# Altium schematic sheet motor_main.SchDoc
size A
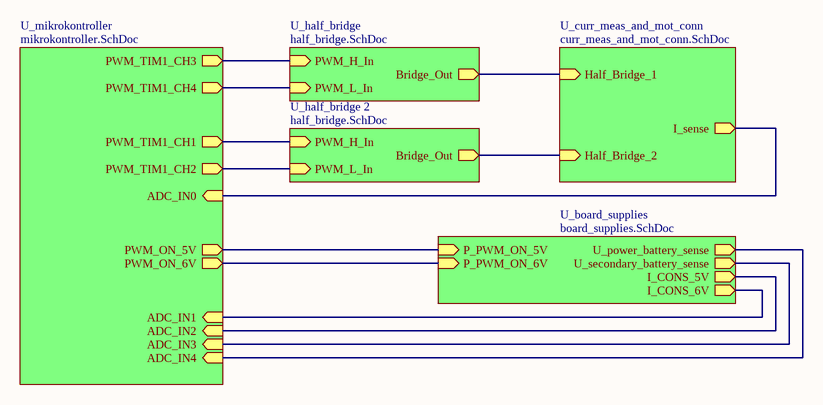
[diagram p0: motor_main.SchDoc]

## Sub-sheets
U_board_supplies = board_supplies.SchDoc: U_power_battery_sense (out), I_CONS_5V (out), P_PWM_ON_5V (in), P_PWM_ON_6V (in), I_CONS_6V (out), U_secondary_battery_sense (out)
U_curr_meas_and_mot_conn = curr_meas_and_mot_conn.SchDoc: Half_Bridge_1 (in), I_sense (out), Half_Bridge_2 (in)
U_half_bridge = half_bridge.SchDoc: PWM_H_In (in), Bridge_Out (out), PWM_L_In (in)
U_half_bridge 2 = half_bridge.SchDoc: PWM_H_In (in), Bridge_Out (out), PWM_L_In (in)
U_mikrokontroller = mikrokontroller.SchDoc: PWM_TIM1_CH1 (out), PWM_TIM1_CH2 (out), PWM_TIM1_CH3 (out), PWM_TIM1_CH4 (out), ADC_IN0 (in), ADC_IN1 (in), ADC_IN4 (in), ADC_IN2 (in), ADC_IN3 (in), PWM_ON_6V (out), PWM_ON_5V (out)

## Nets
(unnamed): sheet U_half_bridge/PWM_H_In, sheet U_mikrokontroller/PWM_TIM1_CH3
(unnamed): sheet U_half_bridge/Bridge_Out, sheet U_curr_meas_and_mot_conn/Half_Bridge_1
(unnamed): sheet U_half_bridge/PWM_L_In, sheet U_mikrokontroller/PWM_TIM1_CH4
(unnamed): sheet U_half_bridge 2/PWM_H_In, sheet U_mikrokontroller/PWM_TIM1_CH1
(unnamed): sheet U_half_bridge 2/Bridge_Out, sheet U_curr_meas_and_mot_conn/Half_Bridge_2
(unnamed): sheet U_half_bridge 2/PWM_L_In, sheet U_mikrokontroller/PWM_TIM1_CH2
(unnamed): sheet U_curr_meas_and_mot_conn/I_sense, sheet U_mikrokontroller/ADC_IN0
(unnamed): sheet U_board_supplies/U_power_battery_sense, sheet U_mikrokontroller/ADC_IN4
(unnamed): sheet U_board_supplies/I_CONS_5V, sheet U_mikrokontroller/ADC_IN2
(unnamed): sheet U_board_supplies/P_PWM_ON_5V, sheet U_mikrokontroller/PWM_ON_5V
(unnamed): sheet U_board_supplies/P_PWM_ON_6V, sheet U_mikrokontroller/PWM_ON_6V
(unnamed): sheet U_board_supplies/I_CONS_6V, sheet U_mikrokontroller/ADC_IN1
(unnamed): sheet U_board_supplies/U_secondary_battery_sense, sheet U_mikrokontroller/ADC_IN3